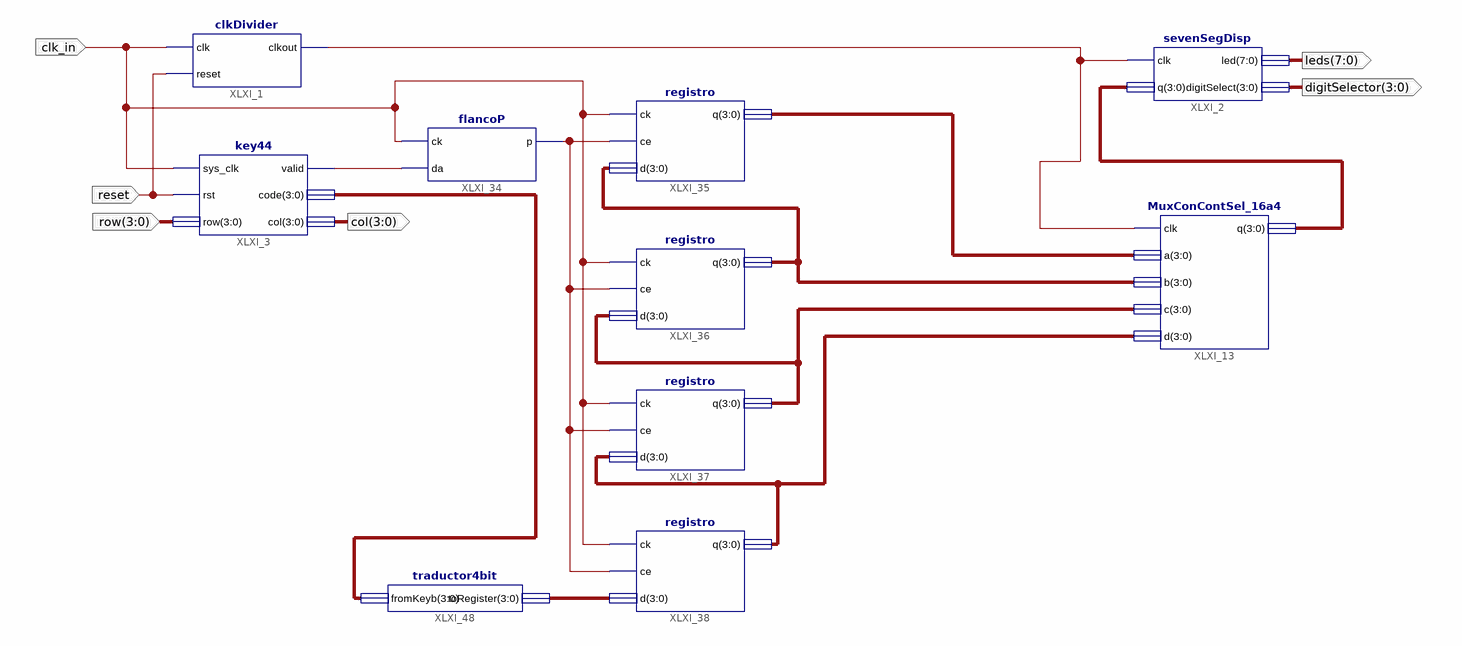
[diagram p0: schematic sheet 1]
// Xilinx ISE schematic top.sch (spartan3e) as structural Verilog: 10 symbols, 6 ports
module top (
  input  reset,
  input  clk_in,
  input  [3:0] row,
  output [3:0] col,
  output [7:0] leds,
  output [3:0] digitSelector
);

  wire XLXN_44, XLXN_129, XLXN_162;
  wire [3:0] XLXN_108, XLXN_163, XLXN_164, XLXN_165, XLXN_166, XLXN_172, XLXN_173;

  clkDivider XLXI_1 (.clk(clk_in), .reset(reset), .clkout(XLXN_44));
  key44 XLXI_3 (.sys_clk(clk_in), .rst(reset), .row(row), .valid(XLXN_129), .code(XLXN_163), .col(col));
  sevenSegDisp XLXI_2 (.clk(XLXN_44), .q(XLXN_108), .led(leds), .digitSelect(digitSelector));
  MuxConContSel_16a4 XLXI_13 (.clk(XLXN_44), .a(XLXN_172), .b(XLXN_173), .c(XLXN_166), .d(XLXN_165), .q(XLXN_108));
  flancoP XLXI_34 (.ck(clk_in), .da(XLXN_129), .p(XLXN_162));
  registro XLXI_36 (.ck(clk_in), .ce(XLXN_162), .d(XLXN_166), .q(XLXN_173));
  registro XLXI_37 (.ck(clk_in), .ce(XLXN_162), .d(XLXN_165), .q(XLXN_166));
  registro XLXI_38 (.ck(clk_in), .ce(XLXN_162), .d(XLXN_164), .q(XLXN_165));
  registro XLXI_35 (.ck(clk_in), .ce(XLXN_162), .d(XLXN_173), .q(XLXN_172));
  traductor4bit XLXI_48 (.fromKeyb(XLXN_163), .toRegister(XLXN_164));
endmodule
